# Altium schematic sheet UI.SchDoc: Plant - UI
size A4; Author: Carlos de la Fuente; CompanyName: eKuore; DrawnBy: Carlos de la Fuente; Engineer: Carlos de la Fuente; Organization: eKuore; Revision: 0.2; SheetNumber: 5; SheetTotal: 5
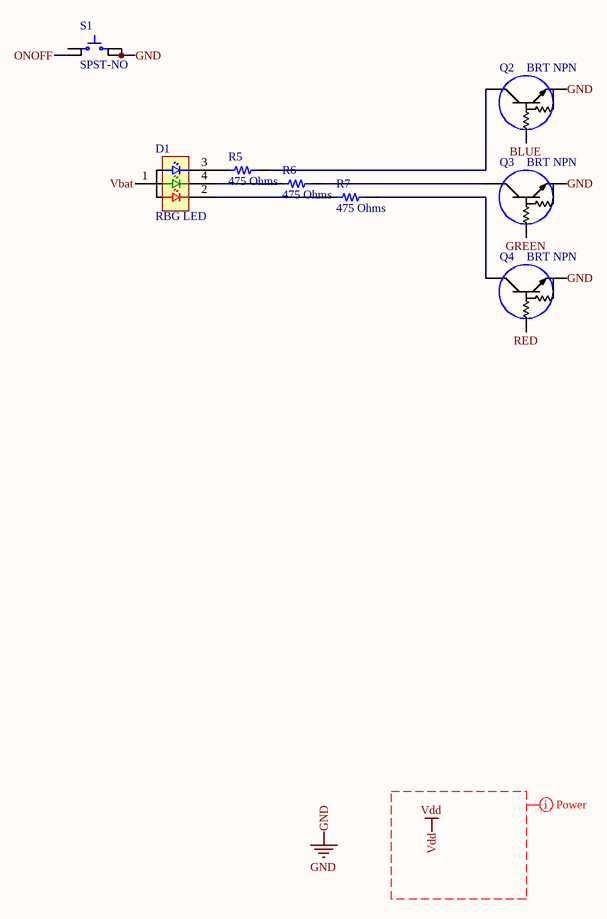
[diagram p0: UI.SchDoc]

## Parts
D1  RBG LED  [LED 0101/0404 RGB]
Q2  BRT NPN  [ON SEMI SOT-416]
Q3  BRT NPN  [ON SEMI SOT-416]
Q4  BRT NPN  [ON SEMI SOT-416]
R5  475 Ohms  [RES 0201_0603]
R6  475 Ohms  [RES 0201_0603]
R7  475 Ohms  [RES 0201_0603]
S1  SPST-NO  [Panasonic evqp7]

## Nets
GND: Q2.2(E) Q3.2(E) Q4.2(E) S1.2 S1.2'
BLUE: Q2.1(B)
GREEN: Q3.1(B)
ONOFF: S1.1'
RED: Q4.1(B)
Vbat: D1.1(A)
NetD1_2: D1.2(C2) R7.1
NetD1_3: D1.3(C3) R5.1
NetD1_4: D1.4(C4) R6.1
NetQ2_3: Q2.3(C) R5.2
NetQ3_3: Q3.3(C) R6.2
NetQ4_3: Q4.3(C) R7.2

Not connected (* = marked no-connect by the designer): S1 1

## Layout directives
net class Power: Vdd

## Notes on the sheet
- Title
- Size:
- Date:
- A4
- Project:
- Time:
- Sheet
- Drawn By:
- Revision:
- of
- File:

## Library data of the parts
D1 = SML-LX0404SIUPGUSB: LED 0404 RBG; Manufacturer: Lumex; Value: RGB; Color: Blue; Viewing Angle: 120°; Forward Current: 2mA; Forward Voltage: 2.73V; Luminous Intensity: 20mcd; Lens Style: Square; Number of LEDs: 3; Power Rating: 30mW; Lens Color: Colorless; Lens Transparency: Clear; Wavelength: 465nm; Part Number: SML-LX0404SIUPGUSB; Revision Date: 08/05/2019; Creation Date: 06/05/2019; Supplier 1: Digi-Key; Supplier Part Number 1: 67-2125-1-ND; Manufacturer Part Number: SML-LX0404SIUPGUSB; Stock 1: 106243; Pricing 1: 1 = 1,29000, 10 = 1,04700, 25 = 0,80560, 100 = 0,7; RoHS: Yes; Mount: Surface Mount; Case/Package: 0404; Case Code (Metric): 1010; Case Code (Imperial): 0404; Min Operating Temperature: -40°C; Max Operating Temperature: 85°C; Package Quantity: 2000; Packaging: Tape and Reel; Test Current: 2mA; Length: 1mm; Height: 0.3mm; Width: 1mm; Lead Free: Lead Free; ComponentLink1URL: https://datasheet.ciiva.com/1333/lumex-quasarbrite; ComponentLink1Description: https://datasheet.ciiva.com/1333/lumex-quasarbrite; ComponentLink2URL: https://datasheet.ciiva.com/4689/sml-lx0404siupgus; ComponentLink2Description: https://datasheet.ciiva.com/4689/sml-lx0404siupgus; ComponentLink3URL: https://datasheet.ciiva.com/1246/1423960-1246392.p; ComponentLink3Description: https://datasheet.ciiva.com/1246/1423960-1246392.p; ComponentLink4URL: https://datasheet.ciiva.com/2118/sml-lx0404siupgus; ComponentLink4Description: https://datasheet.ciiva.com/2118/sml-lx0404siupgus; ComponentLink5URL: https://datasheet.ciiva.com/16199/sml-lx0404siupgu; ComponentLink5Description: https://datasheet.ciiva.com/16199/sml-lx0404siupgu; ComponentLink6URL: https://datasheet.ciiva.com/14604/70127422-1460494; ComponentLink6Description: https://datasheet.ciiva.com/14604/70127422-1460494; REACH SVHC: No SVHC; ComponentLink7URL: https://datasheet.ciiva.com/1246/1484526-1246779.p; ComponentLink7Description: https://datasheet.ciiva.com/1246/1484526-1246779.p; ComponentLink8URL: https://datasheet.ciiva.com/2118/sml-lx0404siupgus; ComponentLink8Description: https://datasheet.ciiva.com/2118/sml-lx0404siupgus; ComponentLink9URL: https://datasheet.ciiva.com/2118/sml-lx0404siupgus; ComponentLink9Description: https://datasheet.ciiva.com/2118/sml-lx0404siupgus
Q2-Q4 = DTC114EET1G: TRANS PREBIAS NPN 200MW SC75; Manufacturer: ON Semiconductor; Collector Emitter Voltage (VCEO): 50V; Element Configuration: Single; hFE Min: 35; Max Collector Current: 100mA; Collector Emitter Saturation Voltage: 250mV; Current Rating: 70mA; Output Voltage: 300mV; Part Number: DTC114EET1G; Revision Date: 08/05/2019; Creation Date: 06/05/2019; Supplier 1: Digi-Key; Supplier Part Number 1: DTC114EET1GOSCT-ND; Manufacturer Part Number: DTC114EET1G; Stock 1: 38538; Pricing 1: 1 = 0,16000, 10 = 0,14200, 100 = 0,07730, 500 = 0,; RoHS: Yes; Case/Package: SOT-416; Number of Pins: 3; Contact Plating: Tin; Min Operating Temperature: -55°C; Max Operating Temperature: 150°C; Package Quantity: 1; Packaging: Tape and Reel; Max Power Dissipation: 200mW; Collector Emitter Breakdown Voltage: 50V; Polarity: NPN; Max Output Current: 100mA; Operating Supply Voltage: 50V; Max Breakdown Voltage: 50V; Continuous Collector Current: 100mA; Voltage Rating (DC): 50V; Length: 1.6mm; Height: 0.75mm; Width: 0.8mm; Radiation Hardening: No; Lead Free: Lead Free; Halogen Free: Halogen Free; REACH SVHC: No SVHC; ComponentLink1URL: https://datasheet.ciiva.com/15139/getdatasheetpart; ComponentLink1Description: https://datasheet.ciiva.com/15139/getdatasheetpart
R5-R7 = CRCW0201475RFKED: RES SMD 475 OHM 1% 1/20W 0201; Manufacturer: Vishay Dale; Power (Watts): 0.05W, 1/20W; Temperature Coefficient: ±100ppm/°C; Part Number: CRCW0201475RFKED; Value: 475 Ohms; ComponentLink1Description: Datasheet; ComponentLink1URL: http://www.vishay.com/docs/20052/crcw0201e3.pdf; ComponentLink2Description: DigiKey Link; ComponentLink2URL: http://digikey.com/product-detail/en/vishay-dale/CRCW0201475RFKED/541-475AABCT-ND/1968203; Composition: Thick Film; Device Package: 0201 (0603 Metric); Height - Seated (Max): 0.011" (0.28mm); LastUpdated: 02/09/2020 1:06:25; Lifecycle Status: Active; Minimum Order: 1; Number of Terminations: 2; Operating Temperature: -55°C ~ 155°C; Package / Case: 0201 (0603 Metric); Packaging: TapeAndReel; PartId: 82; Part Status: Active; Price: 0.03; Resistance: 475 Ohms; Series: CRCW; Size / Dimension: 0.024" L x 0.012" W (0.60mm x 0.30mm); Supplier 1: DigiKey; Supplier Part Number 1: 541-475AABCT-ND; Supplier Device Package: 0201; Tolerance: ±1%
S1 = EVQ-P7A01P: Switch Tactile N.O. SPST Right Angle 0.05A 12V; Manufacturer: Panasonic; Mechanical Life: 100000Cycles; Operating Force: 2.2N; Illumination Type: Non-Illuminated; Switch Travel: 0.2mm; Switch Function: Off-Mom; Contact Resistance: 500mR; Contact Current Rating: 50mA; Actuator Length: 0.65mm; Part Number: EVQ-P7A01P; Revision Date: 08/05/2019; Creation Date: 08/05/2019; Supplier 1: Digi-Key; Supplier Part Number 1: P16763CT-ND; Manufacturer Part Number: EVQ-P7A01P; Stock 1: 641; RoHS: Yes; Mount: Surface Mount; Case/Package: SMD/SMT; Min Operating Temperature: -20°C; Max Operating Temperature: 70°C; Packaging: Tape and Reel; Throw Configuration: SPST; Termination: Gull Wing; Package Quantity: 1; Orientation: Right Angle; ComponentLink1URL: https://datasheet.ciiva.com/30108/atk0000ce20-3010; ComponentLink1Description: https://datasheet.ciiva.com/30108/atk0000ce20-3010; Pricing 1: 1=0,30000, 10=0,28800, 25=0,27840, 50=0,26860, 100; Max Voltage Rating (DC): 12V; Electrical Life: 100000Cycles; Radiation Hardening: No; REACH SVHC: Unknown